# Altium schematic sheet Future-Considerations.SchDoc
size A; SheetNumber: 4; SheetTotal: 4
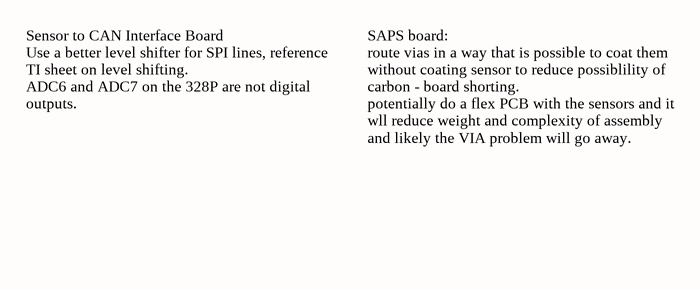
[diagram p0: Future-Considerations.SchDoc]

## Notes on the sheet
- Sensor to CAN Interface Board
  Use a better level shifter for SPI lines, reference TI sheet on level shifting.
  ADC6 and ADC7 on the 328P are not digital outputs.
- SAPS board:
  route vias in a way that is possible to coat them without coating sensor to reduce possiblility of carbon - board shorting.
  potentially do a flex PCB with the sensors and it wll reduce weight and complexity of assembly and likely the VIA problem will go away.